# EAGLE schematic Gibbot v3 (EAGLE 5.12)

## Sheet 1 of 3
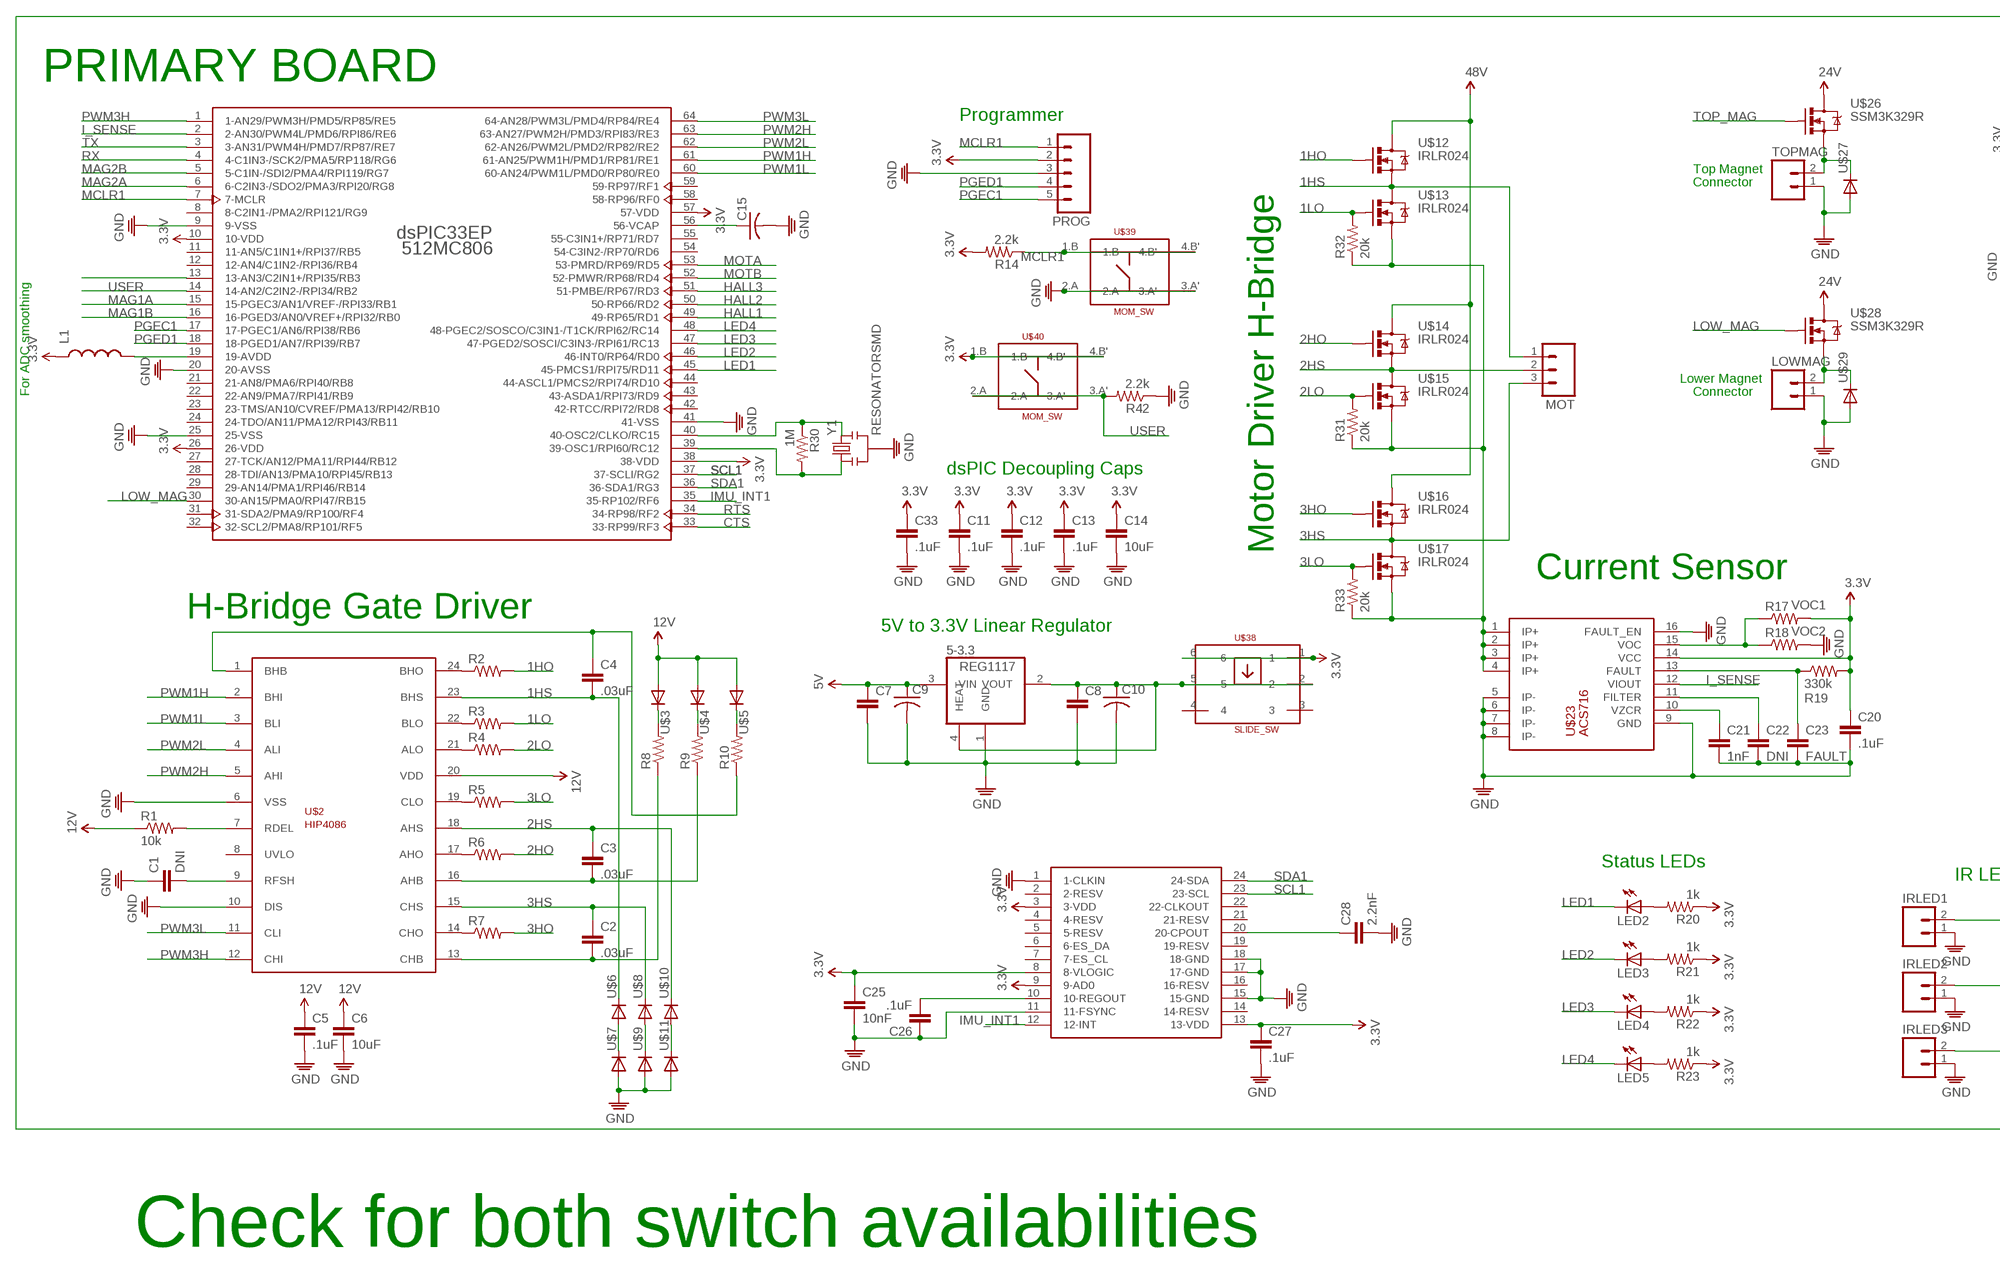
[diagram p0: schematic, sheet 1, part 1 of 2]
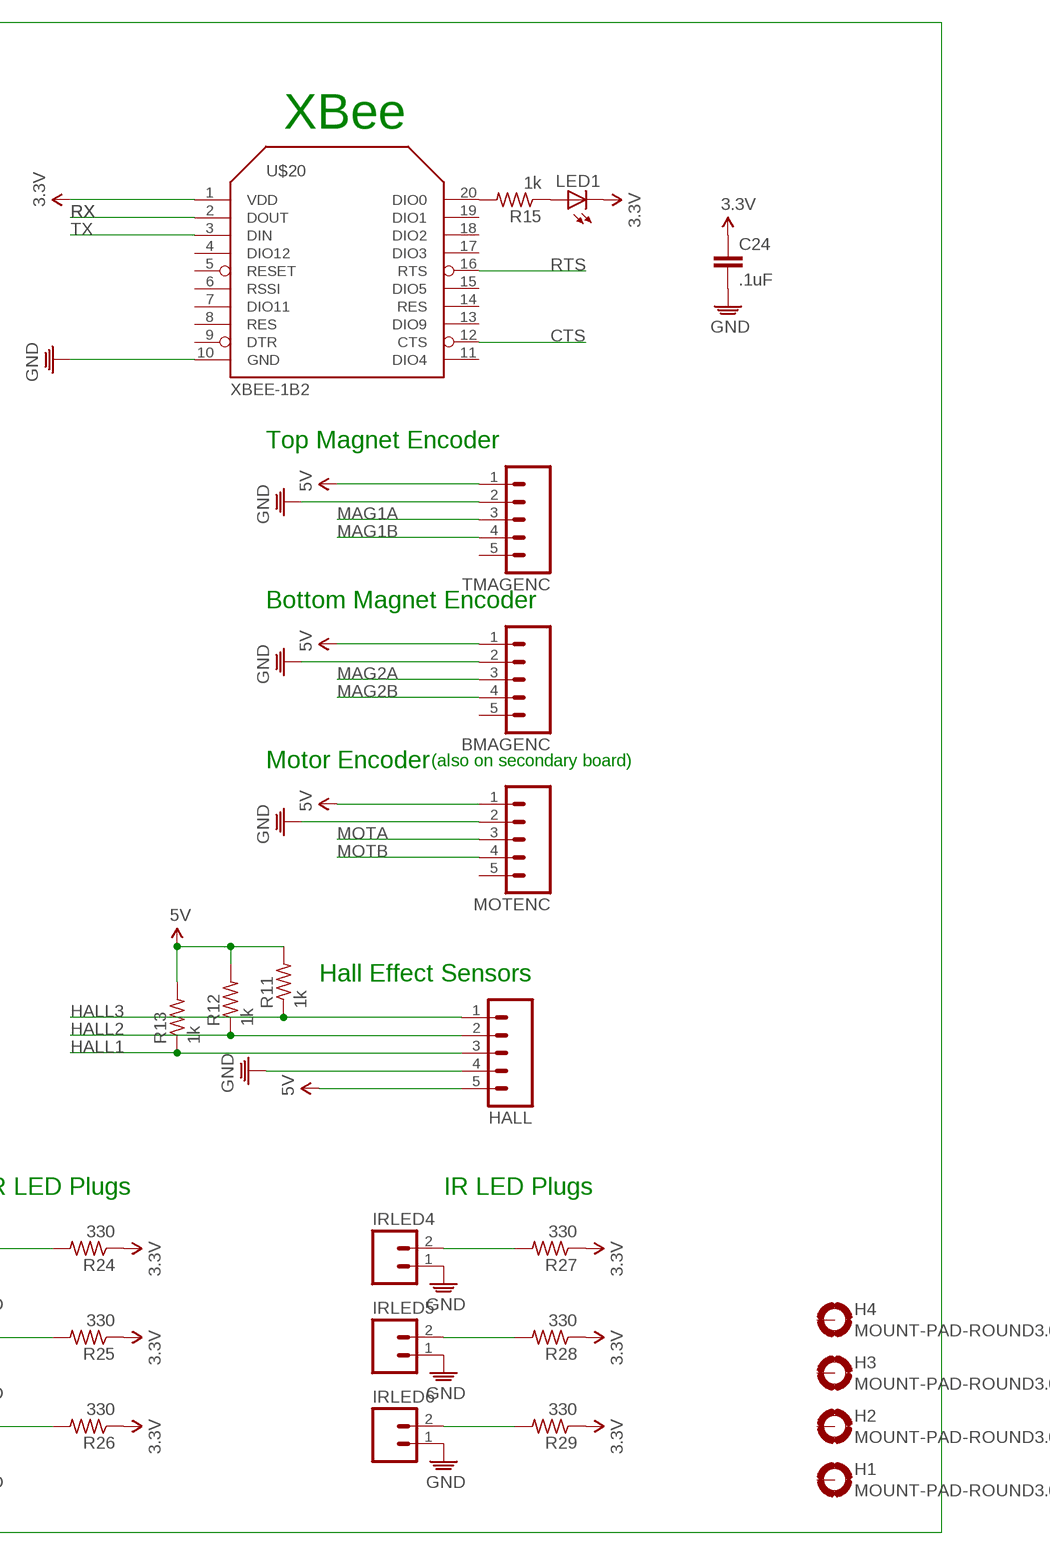
[diagram p1: schematic, sheet 1, part 2 of 2]

### Parts
5-3.3  REG1117  [SOT223]
BMAGENC  M05JST-SH  [JST-SH-5]
C1  DNI  CAP0603-CAP  [0603-CAP]
C2  .03uF  CAP0603-CAP  [0603-CAP]
C3  .03uF  CAP0603-CAP  [0603-CAP]
C4  .03uF  CAP0603-CAP  [0603-CAP]
C5  .1uF  CAP0603-CAP  [0603-CAP]
C6  10uF  CAP_  [AXIAL-5MM]
C7  CAP0603-CAP  [0603-CAP]
C8  CAP0603-CAP  [0603-CAP]
C9  C-USC0603  [C0603]
C10  C-USC0603  [C0603]
C11  .1uF  CAP0603-CAP  [0603-CAP]
C12  .1uF  CAP0603-CAP  [0603-CAP]
C13  .1uF  CAP0603-CAP  [0603-CAP]
C14  10uF  CAPPTH2  [CAP-PTH-SMALL2]
C15  C-USC0603  [C0603]
C20  .1uF  CAP0603-CAP  [0603-CAP]
C21  1nF  CAP0603-CAP  [0603-CAP]
C22  DNI  CAP0603-CAP  [0603-CAP]
C23  FAULT  CAP0603-CAP  [0603-CAP]
C24  .1uF  CAP0603-CAP  [0603-CAP]
C25  10nF  CAP0603-CAP  [0603-CAP]
C26  .1uF  CAP0603-CAP  [0603-CAP]
C27  .1uF  CAP0603-CAP  [0603-CAP]
C28  2.2nF  CAP0603-CAP  [0603-CAP]
C33  .1uF  CAP0603-CAP  [0603-CAP]
H1  MOUNT-PAD-ROUND3.0  [3,0-PAD]
H2  MOUNT-PAD-ROUND3.0  [3,0-PAD]
H3  MOUNT-PAD-ROUND3.0  [3,0-PAD]
H4  MOUNT-PAD-ROUND3.0  [3,0-PAD]
HALL  M05JST-SH  [JST-SH-5]
IRLED1  M02JST-SH  [JST-SH-2]
IRLED2  M02JST-SH  [JST-SH-2]
IRLED3  M02JST-SH  [JST-SH-2]
IRLED4  M02JST-SH  [JST-SH-2]
IRLED5  M02JST-SH  [JST-SH-2]
IRLED6  M02JST-SH  [JST-SH-2]
L1  INDUCTOR0603  [0603]
LED1  LED0603  [LED-0603]
LED2  LED0603  [LED-0603]
LED3  LED0603  [LED-0603]
LED4  LED0603  [LED-0603]
LED5  LED0603  [LED-0603]
LOWMAG  M02JST-SH  [JST-SH-2]
MOT  M03MOLEX-MINI-FIT-JR  [39-30-3036]
MOTENC  M05JST-SH  [JST-SH-5]
PROG  M05PTH  [1X05]
R1  10k  R-US_R0603  [R0603]
R2  R-US_R0603  [R0603]
R3  R-US_R0603  [R0603]
R4  R-US_R0603  [R0603]
R5  R-US_R0603  [R0603]
R6  R-US_R0603  [R0603]
R7  R-US_R0603  [R0603]
R8  R-US_R0603  [R0603]
R9  R-US_R0603  [R0603]
R10  R-US_R0603  [R0603]
R11  1k  R-US_R0603  [R0603]
R12  1k  R-US_R0603  [R0603]
R13  1k  R-US_R0603  [R0603]
R14  2.2k  R-US_R0603  [R0603]
R15  1k  R-US_R0603  [R0603]
R17  VOC1  R-US_R0603  [R0603]
R18  VOC2  R-US_R0603  [R0603]
R19  330k  R-US_R0603  [R0603]
R20  1k  R-US_R0603  [R0603]
R21  1k  R-US_R0603  [R0603]
R22  1k  R-US_R0603  [R0603]
R23  1k  R-US_R0603  [R0603]
R24  330  R-US_R0603  [R0603]
R25  330  R-US_R0603  [R0603]
R26  330  R-US_R0603  [R0603]
R27  330  R-US_R0603  [R0603]
R28  330  R-US_R0603  [R0603]
R29  330  R-US_R0603  [R0603]
R30  1M  R-US_R0603  [R0603]
R31  20k  R-US_R0603  [R0603]
R32  20k  R-US_R0603  [R0603]
R33  20k  R-US_R0603  [R0603]
R42  2.2k  R-US_R0603  [R0603]
TMAGENC  M05JST-SH  [JST-SH-5]
TOPMAG  M02JST-SH  [JST-SH-2]
U$1  DSPIC33EP512MC806  [TQFP64_10X10]
U$2  HIP4086  [SOIC24-W]
U$3  DIODES04  [D0-219AB]
U$4  DIODES04  [D0-219AB]
U$5  DIODES04  [D0-219AB]
U$6  DIODEES1A-D  [DO-214AC]
U$7  DIODEES1A-D  [DO-214AC]
U$8  DIODEES1A-D  [DO-214AC]
U$9  DIODEES1A-D  [DO-214AC]
U$10  DIODEES1A-D  [DO-214AC]
U$11  DIODEES1A-D  [DO-214AC]
U$12  IRLR024  [DPAK]
U$13  IRLR024  [DPAK]
U$14  IRLR024  [DPAK]
U$15  IRLR024  [DPAK]
U$16  IRLR024  [DPAK]
U$17  IRLR024  [DPAK]
U$20  XBEE-1B2  [XBEE-SILK]
U$23  ACS716  [SOIC16-W]
U$26  SSM3K329R  [SOT23F]
U$27  DIODE1N4148  [DIODE-1N4148]
U$28  SSM3K329R  [SOT23F]
U$29  DIODE1N4148  [DIODE-1N4148]
U$30  MPU-9150  [LGA24_4X4]
U$38  SLIDE_SW  [SLIDE_SW]
U$39  MOM_SW  [MOM_SW]
U$40  MOM_SW  [MOM_SW]
Y1  RESONATORSMD  [RESONATOR-SMD]

### Nets
1HO: R2.2 U$12.G
1HS: C4.2 MOT.1 U$2.23(BHS) U$6.CATH(C) U$12.S U$13.D
1LO: R3.2 R32.2 U$13.G
2HO: R6.2 U$14.G
2HS: C3.1 MOT.2 U$2.18(AHS) U$10.CATH(C) U$14.S U$15.D
2LO: R4.2 R31.2 U$15.G
3.3V: C11.1 C12.1 C13.1 C14.1 C20.1 C24.1 C25.1 C27.1 C33.1 L1.1 LED1.C PROG.2 R14.2 R17.2 R19.2 R20.1 R21.1 R22.1 R23.1 R24.1 R25.1 R26.1 R27.1 R28.1 R29.1 U$1.10(10-VDD) U$1.26(26-VDD) U$1.38(38-VDD) U$1.57(57-VDD) U$20.1(VDD) U$23.14(VCC) U$30.3(3-VDD) U$30.8(8-VLOGIC) U$30.9(9-AD0) U$30.13(13-VDD) U$38.1 U$38.6 U$40.1.B U$40.4.B' ; also sheet 3
3HO: R7.2 U$16.G
3HS: C2.1 MOT.3 U$2.15(CHS) U$8.CATH(C) U$16.S U$17.D
3LO: R5.2 R33.2 U$17.G
5V: 5-3.3.3(VIN) BMAGENC.1 C7.1 C9.1 HALL.5 MOTENC.1 R11.2 R12.2 R13.2 TMAGENC.1 ; also sheet 3
12V: C5.1 C6.P$1 R1.1 U$2.20(VDD) U$3.AN(A) U$4.AN(A) U$5.AN(A)
24V: U$26.D U$28.D ; also sheet 3
48V: U$12.D U$14.D U$16.D
CTS: U$1.33(33-RP99/RF3) U$20.12(CTS)
GND: 5-3.3.1(GND) BMAGENC.2 C1.1 C5.2 C6.P$2 C7.2 C8.2 C9.2 C10.2 C11.2 C12.2 C13.2 C14.2 C15.2 C20.2 C21.2 C22.2 C23.2 C24.2 C25.2 C26.1 C27.2 C28.2 C33.2 HALL.4 IRLED1.1 IRLED2.1 IRLED3.1 IRLED4.1 IRLED5.1 IRLED6.1 LOWMAG.1 MOTENC.2 PROG.3 R18.2 R42.1 TMAGENC.2 TOPMAG.1 U$1.9(9-VSS) U$1.20(20-AVSS) U$1.25(25-VSS) U$1.41(41-VSS) U$2.6(VSS) U$2.10(DIS) U$7.AN(A) U$9.AN(A) U$11.AN(A) U$20.10(GND) U$23.5(IP-) U$23.6(IP-) U$23.7(IP-) U$23.8(IP-) U$23.9(GND) U$23.16(FAULT_EN) U$27.A U$29.A U$30.1(1-CLKIN) U$30.11(11-FSYNC) U$30.15(15-GND) U$30.17(17-GND) U$30.18(18-GND) U$39.2.A U$39.3.A' Y1.2 ; also sheet 3
HALL1: HALL.3 R13.1 U$1.49(49-RP65/RD1)
HALL2: HALL.2 R12.1 U$1.50(50-RP66/RD2)
HALL3: HALL.1 R11.1 U$1.51(51-PMBE/RP67/RD3)
I_SENSE: U$1.2(2-AN30/PWM4L/PMD6/RPI86/RE6) U$23.12(VIOUT)
IMU_INT1: U$1.35(35-RP102/RF6) U$30.12(12-INT)
IRLED6: IRLED6.2 R29.2
LED1: LED2.C U$1.45(45-PMCS1/RPI75/RD11)
LED2: LED3.C U$1.46(46-INT0/RP64/RD0)
LED3: LED4.C U$1.47(47-PGED2/SOSCI/C3IN3-/RPI61/RC13)
LED4: LED5.C U$1.48(48-PGEC2/SOSCO/C3IN1-/T1CK/RPI62/RC14)
LOW_MAG: U$1.30(30-AN15/PMA0/RPI47/RB15) U$28.G
MAG1A: TMAGENC.3 U$1.15(15-PGEC3/AN1/VREF-/RPI33/RB1)
MAG1B: TMAGENC.4 U$1.16(16-PGED3/AN0/VREF+/RPI32/RB0)
MAG2A: BMAGENC.3 U$1.6(6-C2IN3-/SDO2/PMA3/RPI20/RG8)
MAG2B: BMAGENC.4 U$1.5(5-C1IN-/SDI2/PMA4/RPI119/RG7)
MCLR1: PROG.1 R14.1 U$1.7(7-MCLR) U$39.1.B U$39.4.B'
MOTA: MOTENC.3 U$1.53(53-PMRD/RP69/RD5)
MOTB: MOTENC.4 U$1.52(52-PMWR/RP68/RD4)
N$4: R1.2 U$2.7(RDEL)
N$5: C1.2 U$2.9(RFSH)
N$6: R2.1 U$2.24(BHO)
N$7: R3.1 U$2.22(BLO)
N$8: R4.1 U$2.21(ALO)
N$9: R5.1 U$2.19(CLO)
N$10: R6.1 U$2.17(AHO)
N$11: R7.1 U$2.14(CHO)
N$12: C2.2 R8.1 U$2.13(CHB)
N$13: C3.2 R9.1 U$2.16(AHB)
N$14: R15.2 U$20.20(DIO0)
N$15: LED1.A R15.1
N$16: C15.1 U$1.56(56-VCAP)
N$17: C4.1 R10.1 U$2.1(BHB)
N$18: R10.2 U$5.CATH(C)
N$19: R9.2 U$4.CATH(C)
N$20: R8.2 U$3.CATH(C)
N$21: U$6.AN(A) U$7.CATH(C)
N$22: U$8.AN(A) U$9.CATH(C)
N$23: U$10.AN(A) U$11.CATH(C)
N$24: C23.1 R19.1 U$23.13(FAULT)
N$25: C21.1 U$23.10(VZCR)
N$27: C22.1 U$23.11(FILTER)
N$28: R31.1 R32.1 R33.1 U$13.S U$15.S U$17.S U$23.1(IP+) U$23.2(IP+) U$23.3(IP+) U$23.4(IP+)
N$29: LED2.A R20.2
N$30: LED3.A R21.2
N$31: LED4.A R22.2
N$32: R17.1 R18.1 U$23.15(VOC)
N$34: U$1.13(13-AN3/C2IN1+/RPI35/RB3)
N$39: LED5.A R23.2
N$40: TOPMAG.2 U$26.S U$27.C
N$41: LOWMAG.2 U$28.S U$29.C
N$42: R30.2 U$1.39(39-OSC1/RPI60/RC12) Y1.1
N$43: R30.1 U$1.40(40-OSC2/CLKO/RC15) Y1.3
N$44: C26.2 U$30.10(10-REGOUT)
N$45: IRLED1.2 R24.2
N$46: C28.1 U$30.20(20-CPOUT)
N$47: IRLED2.2 R25.2
N$49: IRLED3.2 R26.2
N$51: IRLED4.2 R27.2
N$53: IRLED5.2 R28.2
N$56: 5-3.3.2(VOUT) 5-3.3.4(HEAT) C8.1 C10.1 U$38.2 U$38.5
N$57: L1.2 U$1.19(19-AVDD)
PGEC1: PROG.5 U$1.17(17-PGEC1/AN6/RPI38/RB6)
PGED1: PROG.4 U$1.18(18-PGED1/AN7/RPI39/RB7)
PWM1H: U$1.61(61-AN25/PWM1H/PMD1/RP81/RE1) U$2.2(BHI)
PWM1L: U$1.60(60-AN24/PWM1L/PMD0/RP80/RE0) U$2.3(BLI)
PWM2H: U$1.63(63-AN27/PWM2H/PMD3/RPI83/RE3) U$2.5(AHI)
PWM2L: U$1.62(62-AN26/PWM2L/PMD2/RP82/RE2) U$2.4(ALI)
PWM3H: U$1.1(1-AN29/PWM3H/PMD5/RP85/RE5) U$2.12(CHI)
PWM3L: U$1.64(64-AN28/PWM3L/PMD4/RP84/RE4) U$2.11(CLI)
RTS: U$1.34(34-RP98/RF2) U$20.16(RTS)
RX: U$1.4(4-C1IN3-/SCK2/PMA5/RP118/RG6) U$20.2(DOUT)
SCL1: U$1.37(37-SCLI/RG2) U$30.23(23-SCL)
SDA1: U$1.36(36-SDA1/RG3) U$30.24(24-SDA)
TOP_MAG: U$26.G
TX: U$1.3(3-AN31/PWM4H/PMD7/RP87/RE7) U$20.3(DIN)
USER: R42.2 U$1.14(14-AN2/C2IN2-/RPI34/RB2) U$40.2.A U$40.3.A' ; also sheet 3
Unconnected: BMAGENC.5 H1.B3,0(MOUNT) H2.B3,0(MOUNT) H3.B3,0(MOUNT) H4.B3,0(MOUNT) MOTENC.5 TMAGENC.5 U$1.8(8-C2IN1-/PMA2/RPI121/RG9) U$1.11(11-AN5/C1IN1+/RPI37/RB5) U$1.12(12-AN4/C1IN2-/RPI36/RB4) U$1.21(21-AN8/PMA6/RPI40/RB8) U$1.22(22-AN9/PMA7/RPI41/RB9) U$1.23(23-TMS/AN10/CVREF/PMA13/RPI42/RB10) U$1.24(24-TDO/AN11/PMA12/RPI43/RB11) U$1.27(27-TCK/AN12/PMA11/RPI44/RB12) U$1.28(28-TDI/AN13/PMA10/RPI45/RB13) U$1.29(29-AN14/PMA1/RPI46/RB14) U$1.31(31-SDA2/PMA9/RP100/RF4) U$1.32(32-SCL2/PMA8/RP101/RF5) U$1.42(42-RTCC/RPI72/RD8) U$1.43(43-ASDA1/RPI73/RD9) U$1.44(44-ASCL1/PMCS2/RPI74/RD10) U$1.54(54-C3IN2-/RP70/RD6) U$1.55(55-C3IN1+/RP71/RD7) U$1.58(58-RP96/RF0) U$1.59(59-RP97/RF1) U$2.8(UVLO) U$20.4(DIO12) U$20.5(RESET) U$20.6(RSSI) U$20.7(DIO11) U$20.8(RES) U$20.9(DTR) U$20.11(DIO4) U$20.13(DIO9) U$20.14(RES) U$20.15(DIO5) U$20.17(DIO3) U$20.18(DIO2) U$20.19(DIO1) U$30.2(2-RESV) U$30.4(4-RESV) U$30.5(5-RESV) U$30.6(6-ES_DA) U$30.7(7-ES_CL) U$30.14(14-RESV) U$30.16(16-RESV) U$30.19(19-RESV) U$30.21(21-RESV) U$30.22(22-CLKOUT) U$38.3 U$38.4

### Notes on the sheet
- PRIMARY BOARD
- XBee
- Programmer
- Top Magnet
- Connector
- Top Magnet Encoder
- Lower Magnet
- For ADC smoothing | Connector
- Bottom Magnet Encoder
- dsPIC Decoupling Caps
- Motor Driver H-Bridge
- Motor Encoder | (also on secondary board)
- Current Sensor
- H-Bridge Gate Driver
- 5V to 3.3V Linear Regulator
- Hall Effect Sensors
- Status LEDs
- IR LED Plugs | IR LED Plugs
- Check for both switch availabilities

## Sheet 2 of 3
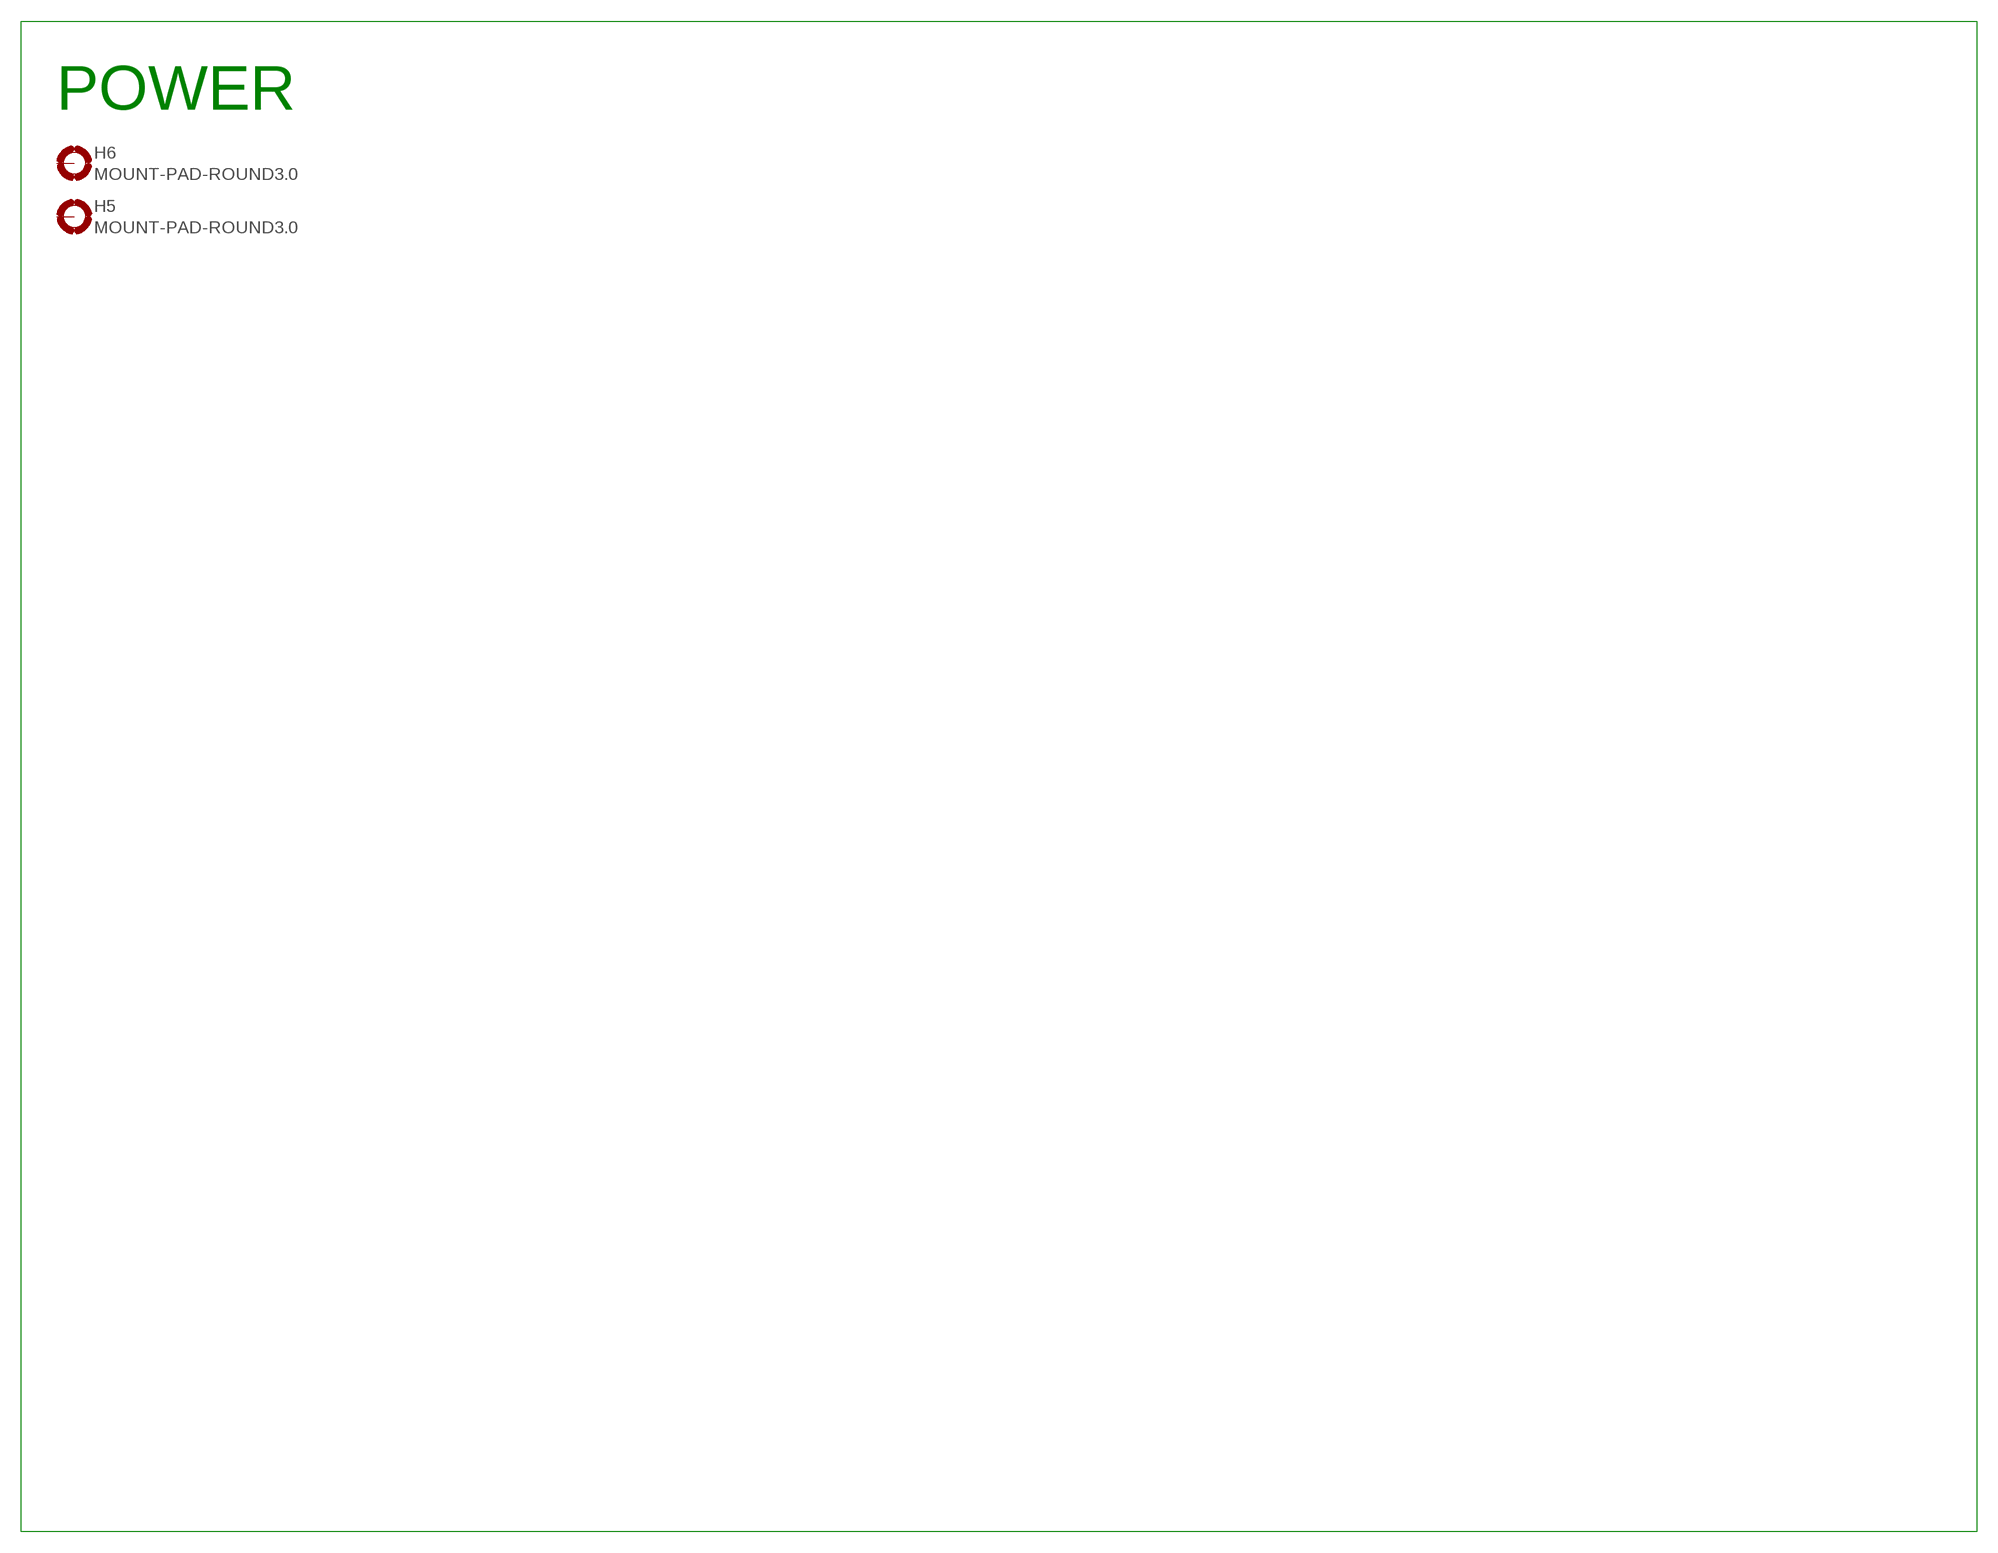
[diagram p2: schematic, sheet 2]

### Parts
H5  MOUNT-PAD-ROUND3.0  [3,0-PAD]
H6  MOUNT-PAD-ROUND3.0  [3,0-PAD]
Unconnected: H5.B3,0(MOUNT) H6.B3,0(MOUNT)

### Notes on the sheet
- POWER

## Sheet 3 of 3
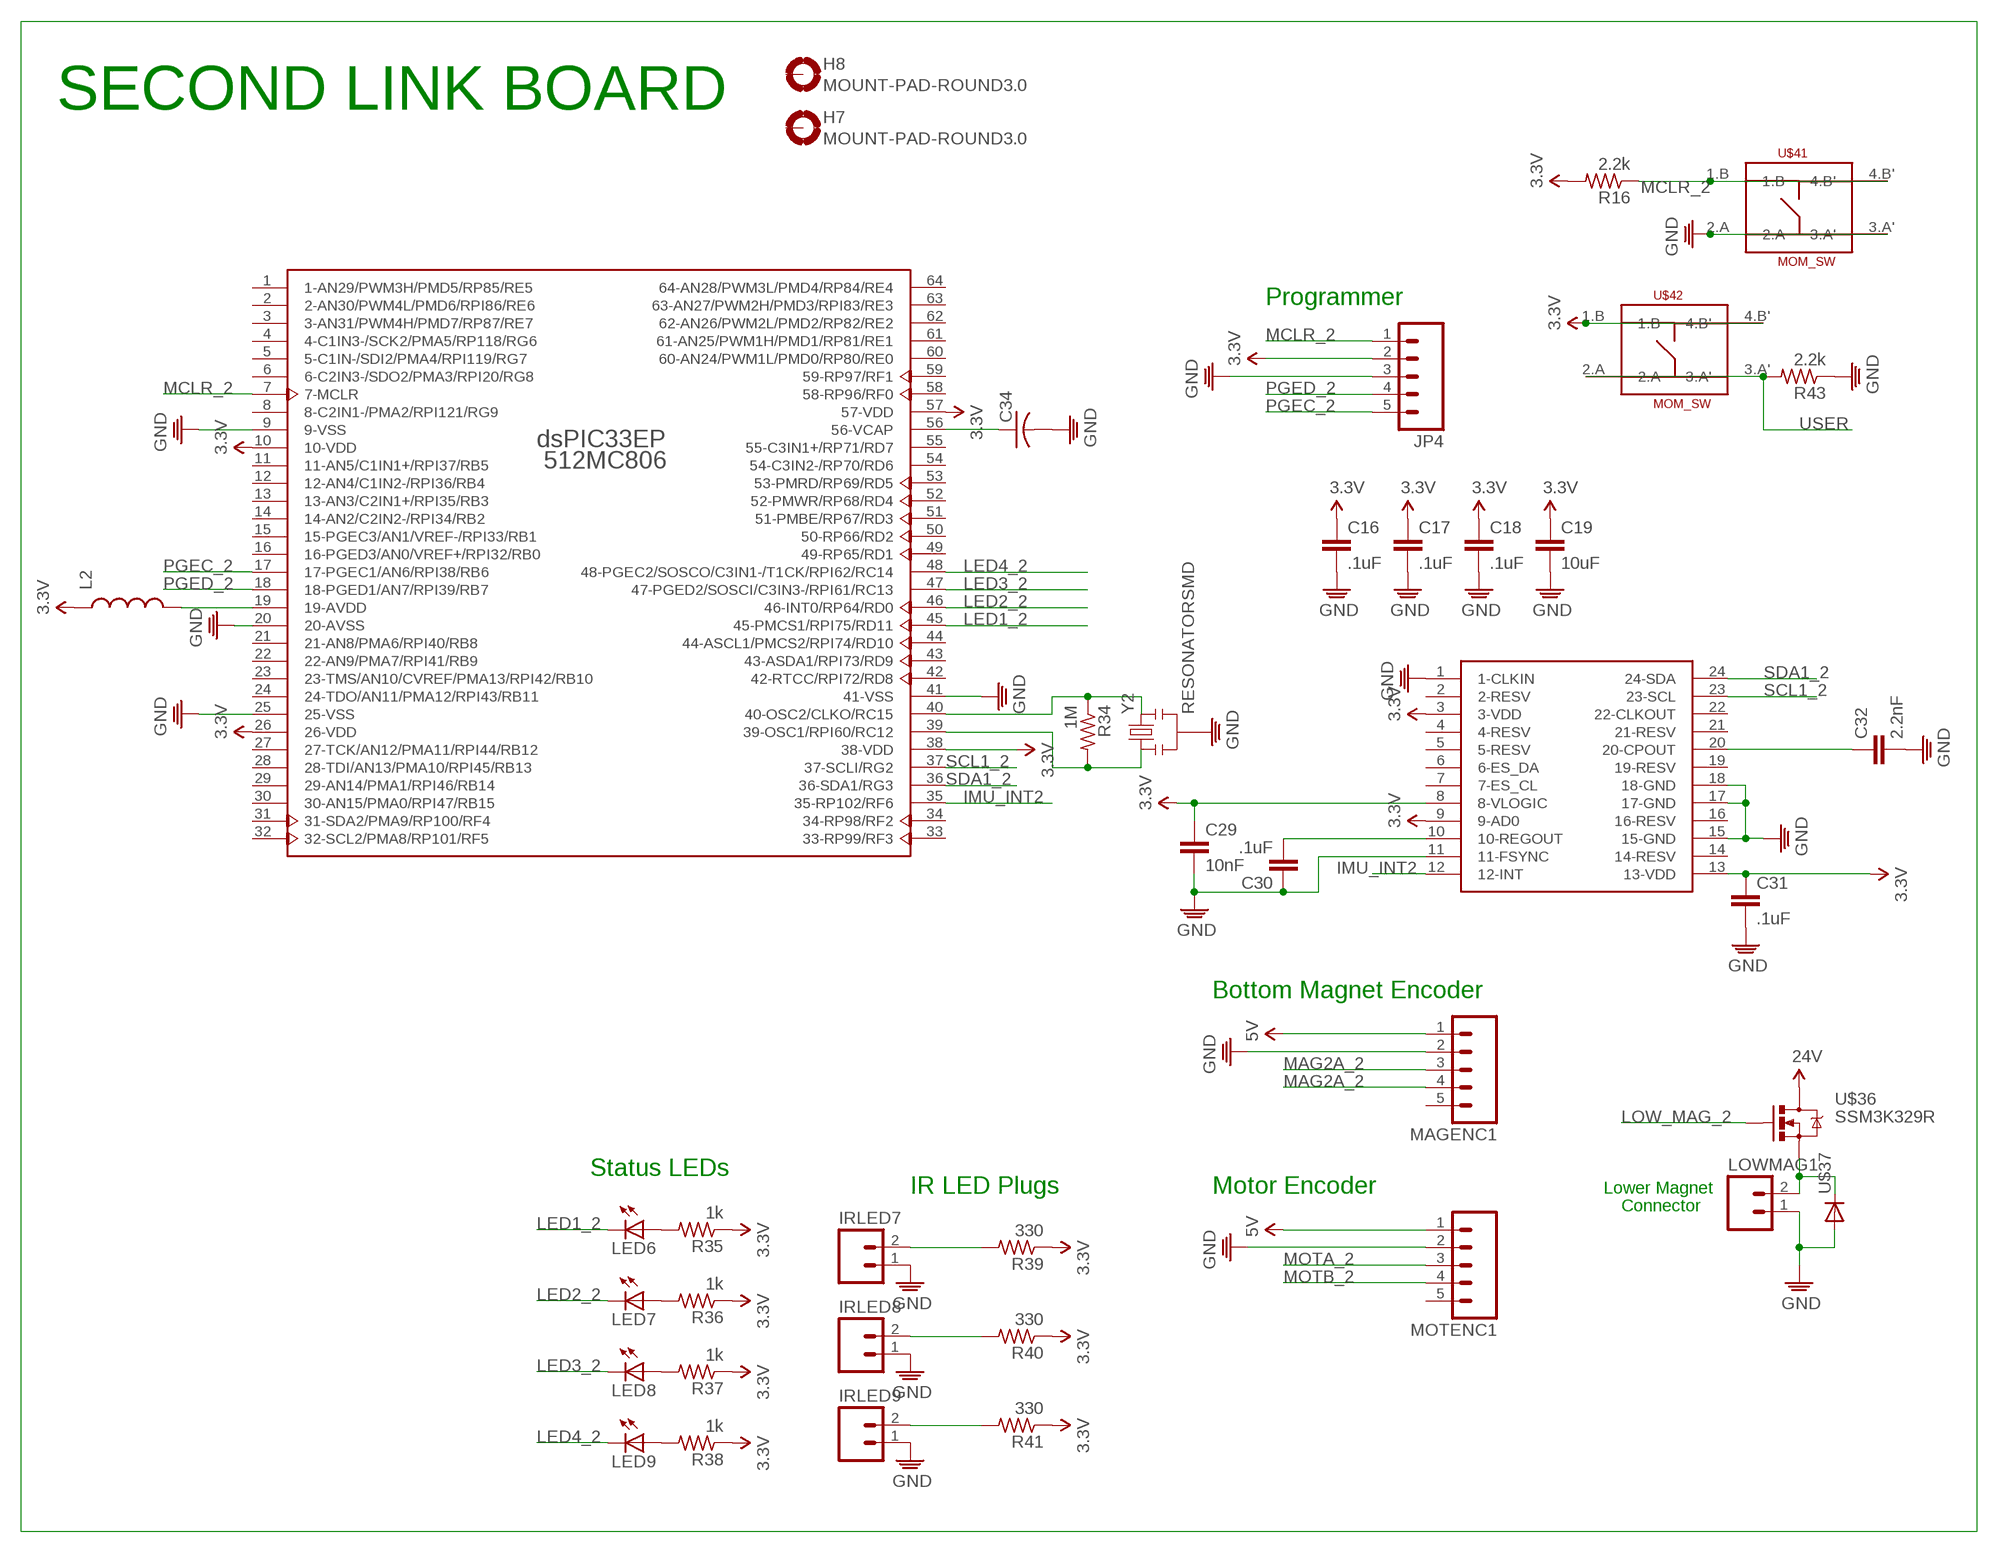
[diagram p3: schematic, sheet 3]

### Parts
C16  .1uF  CAP0603-CAP  [0603-CAP]
C17  .1uF  CAP0603-CAP  [0603-CAP]
C18  .1uF  CAP0603-CAP  [0603-CAP]
C19  10uF  CAPPTH2  [CAP-PTH-SMALL2]
C29  10nF  CAP0603-CAP  [0603-CAP]
C30  .1uF  CAP0603-CAP  [0603-CAP]
C31  .1uF  CAP0603-CAP  [0603-CAP]
C32  2.2nF  CAP0603-CAP  [0603-CAP]
C34  C-USC0603  [C0603]
H7  MOUNT-PAD-ROUND3.0  [3,0-PAD]
H8  MOUNT-PAD-ROUND3.0  [3,0-PAD]
IRLED7  M02JST-SH  [JST-SH-2]
IRLED8  M02JST-SH  [JST-SH-2]
IRLED9  M02JST-SH  [JST-SH-2]
JP4  M05PTH  [1X05]
L2  INDUCTOR0603  [0603]
LED6  LED0603  [LED-0603]
LED7  LED0603  [LED-0603]
LED8  LED0603  [LED-0603]
LED9  LED0603  [LED-0603]
LOWMAG1  M02JST-SH  [JST-SH-2]
MAGENC1  M05JST-SH  [JST-SH-5]
MOTENC1  M05JST-SH  [JST-SH-5]
R16  2.2k  R-US_R0603  [R0603]
R34  1M  R-US_R0603  [R0603]
R35  1k  R-US_R0603  [R0603]
R36  1k  R-US_R0603  [R0603]
R37  1k  R-US_R0603  [R0603]
R38  1k  R-US_R0603  [R0603]
R39  330  R-US_R0603  [R0603]
R40  330  R-US_R0603  [R0603]
R41  330  R-US_R0603  [R0603]
R43  2.2k  R-US_R0603  [R0603]
U$22  DSPIC33EP512MC806  [TQFP64_10X10]
U$31  MPU-9150  [LGA24_4X4]
U$36  SSM3K329R  [SOT23F]
U$37  DIODE1N4148  [DIODE-1N4148]
U$41  MOM_SW  [MOM_SW]
U$42  MOM_SW  [MOM_SW]
Y2  RESONATORSMD  [RESONATOR-SMD]

### Nets
3.3V: C16.1 C17.1 C18.1 C19.1 C29.1 C31.1 JP4.2 L2.1 R16.2 R35.1 R36.1 R37.1 R38.1 R39.1 R40.1 R41.1 U$22.10(10-VDD) U$22.26(26-VDD) U$22.38(38-VDD) U$22.57(57-VDD) U$31.3(3-VDD) U$31.8(8-VLOGIC) U$31.9(9-AD0) U$31.13(13-VDD) U$42.1.B U$42.4.B' ; also sheet 1
5V: MAGENC1.1 MOTENC1.1 ; also sheet 1
24V: U$36.D ; also sheet 1
GND: C16.2 C17.2 C18.2 C19.2 C29.2 C30.1 C31.2 C32.2 C34.2 IRLED7.1 IRLED8.1 IRLED9.1 JP4.3 LOWMAG1.1 MAGENC1.2 MOTENC1.2 R43.1 U$22.9(9-VSS) U$22.20(20-AVSS) U$22.25(25-VSS) U$22.41(41-VSS) U$31.1(1-CLKIN) U$31.11(11-FSYNC) U$31.15(15-GND) U$31.17(17-GND) U$31.18(18-GND) U$37.A U$41.2.A U$41.3.A' Y2.2 ; also sheet 1
IMU_INT2: U$22.35(35-RP102/RF6) U$31.12(12-INT)
LED1_2: LED6.C U$22.45(45-PMCS1/RPI75/RD11)
LED2_2: LED7.C U$22.46(46-INT0/RP64/RD0)
LED3_2: LED8.C U$22.47(47-PGED2/SOSCI/C3IN3-/RPI61/RC13)
LED4_2: LED9.C U$22.48(48-PGEC2/SOSCO/C3IN1-/T1CK/RPI62/RC14)
LOW_MAG_2: U$36.G
MAG2A_2: MAGENC1.3 MAGENC1.4
MCLR_2: JP4.1 R16.1 U$22.7(7-MCLR) U$41.1.B U$41.4.B'
MOTA_2: MOTENC1.3
MOTB_2: MOTENC1.4
N$33: L2.2 U$22.19(19-AVDD)
N$35: C34.1 U$22.56(56-VCAP)
N$36: R34.2 U$22.39(39-OSC1/RPI60/RC12) Y2.1
N$37: R34.1 U$22.40(40-OSC2/CLKO/RC15) Y2.3
N$48: C30.2 U$31.10(10-REGOUT)
N$50: C32.1 U$31.20(20-CPOUT)
N$52: LOWMAG1.2 U$36.S U$37.C
N$55: LED6.A R35.2
N$58: LED7.A R36.2
N$59: LED8.A R37.2
N$60: LED9.A R38.2
N$61: IRLED7.2 R39.2
N$62: IRLED8.2 R40.2
N$63: IRLED9.2 R41.2
PGEC_2: JP4.5 U$22.17(17-PGEC1/AN6/RPI38/RB6)
PGED_2: JP4.4 U$22.18(18-PGED1/AN7/RPI39/RB7)
SCL1_2: U$22.37(37-SCLI/RG2) U$31.23(23-SCL)
SDA1_2: U$22.36(36-SDA1/RG3) U$31.24(24-SDA)
USER: R43.2 U$42.2.A U$42.3.A' ; also sheet 1
Unconnected: H7.B3,0(MOUNT) H8.B3,0(MOUNT) MAGENC1.5 MOTENC1.5 U$22.1(1-AN29/PWM3H/PMD5/RP85/RE5) U$22.2(2-AN30/PWM4L/PMD6/RPI86/RE6) U$22.3(3-AN31/PWM4H/PMD7/RP87/RE7) U$22.4(4-C1IN3-/SCK2/PMA5/RP118/RG6) U$22.5(5-C1IN-/SDI2/PMA4/RPI119/RG7) U$22.6(6-C2IN3-/SDO2/PMA3/RPI20/RG8) U$22.8(8-C2IN1-/PMA2/RPI121/RG9) U$22.11(11-AN5/C1IN1+/RPI37/RB5) U$22.12(12-AN4/C1IN2-/RPI36/RB4) U$22.13(13-AN3/C2IN1+/RPI35/RB3) U$22.14(14-AN2/C2IN2-/RPI34/RB2) U$22.15(15-PGEC3/AN1/VREF-/RPI33/RB1) U$22.16(16-PGED3/AN0/VREF+/RPI32/RB0) U$22.21(21-AN8/PMA6/RPI40/RB8) U$22.22(22-AN9/PMA7/RPI41/RB9) U$22.23(23-TMS/AN10/CVREF/PMA13/RPI42/RB10) U$22.24(24-TDO/AN11/PMA12/RPI43/RB11) U$22.27(27-TCK/AN12/PMA11/RPI44/RB12) U$22.28(28-TDI/AN13/PMA10/RPI45/RB13) U$22.29(29-AN14/PMA1/RPI46/RB14) U$22.30(30-AN15/PMA0/RPI47/RB15) U$22.31(31-SDA2/PMA9/RP100/RF4) U$22.32(32-SCL2/PMA8/RP101/RF5) U$22.33(33-RP99/RF3) U$22.34(34-RP98/RF2) U$22.42(42-RTCC/RPI72/RD8) U$22.43(43-ASDA1/RPI73/RD9) U$22.44(44-ASCL1/PMCS2/RPI74/RD10) U$22.49(49-RP65/RD1) U$22.50(50-RP66/RD2) U$22.51(51-PMBE/RP67/RD3) U$22.52(52-PMWR/RP68/RD4) U$22.53(53-PMRD/RP69/RD5) U$22.54(54-C3IN2-/RP70/RD6) U$22.55(55-C3IN1+/RP71/RD7) U$22.58(58-RP96/RF0) U$22.59(59-RP97/RF1) U$22.60(60-AN24/PWM1L/PMD0/RP80/RE0) U$22.61(61-AN25/PWM1H/PMD1/RP81/RE1) U$22.62(62-AN26/PWM2L/PMD2/RP82/RE2) U$22.63(63-AN27/PWM2H/PMD3/RPI83/RE3) U$22.64(64-AN28/PWM3L/PMD4/RP84/RE4) U$31.2(2-RESV) U$31.4(4-RESV) U$31.5(5-RESV) U$31.6(6-ES_DA) U$31.7(7-ES_CL) U$31.14(14-RESV) U$31.16(16-RESV) U$31.19(19-RESV) U$31.21(21-RESV) U$31.22(22-CLKOUT)

### Notes on the sheet
- SECOND LINK BOARD
- Programmer
- Bottom Magnet Encoder
- Status LEDs
- IR LED Plugs | Motor Encoder | Lower Magnet
- Connector

## Library data of the parts
5-3.3 = Gibbot:REG1117: 800mA and 1A Low Dropout (LDO) Positive Regulator 1.8V, 2.5V, 2.85V, 3.3V, 5V, and Adj
BMAGENC HALL JP4 MAGENC1 MOTENC MOTENC1 PROG TMAGENC = Gibbot:M05: Header 5 Standard 5-pin 0.1" header. Use with straight break away headers (SKU : PRT-00116), right angle break away headers (PRT-00553), swiss pins (PRT-00743), machine pins (PRT-00117), and female headers (PRT-00115). Molex polarized connector foot print use with SKU : PRT-08230 with associated crimp pins and housings.
C1-C8 C11-C14 C16-C33 = Gibbot:CAP: Capacitor Standard 0603 ceramic capacitor, and 0.1" leaded capacitor.
C9 C10 C15 C34 = Gibbot:C-US: CAPACITOR, American symbol
H1-H8 = Gibbot:MOUNT-PAD-ROUND: MOUNTING PAD, round
IRLED1-IRLED9 LOWMAG LOWMAG1 TOPMAG = Gibbot:M02: Header 2 Standard 2-pin 0.1" header. Use with straight break away headers (SKU : PRT-00116), right angle break away headers (PRT-00553), swiss pins (PRT-00743), machine pins (PRT-00117), and female headers (PRT-00115). Molex polarized connector foot print use with SKU : PRT-08233 with associated crimp pins and housings.
L1 L2 = Gibbot:INDUCTOR: Inductors Basic Inductor/Choke - 0603 and 1206. Footprints are not proven and vary greatly between part numbers.
LED1-LED9 = Gibbot:LED: LEDs Standard schematic elements and footprints for 5mm, 3mm, 1206, and 0603 sized LEDs. 5mm - Spark Fun Electronics SKU : COM-00529 (and others)
MOT = Gibbot:M03: Header 3 Standard 3-pin 0.1" header. Use with straight break away headers (SKU : PRT-00116), right angle break away headers (PRT-00553), swiss pins (PRT-00743), machine pins (PRT-00117), and female headers (PRT-00115). Molex polarized connector foot print use with SKU : PRT-08232 with associated crimp pins and housings.
R1-R43 = Gibbot:R-US_: RESISTOR, American symbol
U$1 U$22 = Gibbot:DSPIC33EP512MC806
U$2 = Gibbot:HIP4086
U$3-U$11 U$27 U$29 U$37 = Gibbot:DIODE: Diode These are standard reverse protection diodes and small signal diodes. SMA package can handle up to about 1A. SOD-323 can handle about 200mA. What the SOD-323 package when ordering, there are some mfgs out there that are 5-pin packages.
U$12-U$17 = Gibbot:IRLR024
U$20 = Gibbot:XBEE-1
U$23 = Gibbot:ACS716
U$26 U$28 U$36 = Gibbot:SSM3K329R
U$30 U$31 = Gibbot:MPU-9150
U$38 = Gibbot:SLIDE_SW
U$39-U$42 = Gibbot:MOM_SW
Y1 Y2 = Gibbot:RESONATOR: Resonator Small SMD resonator. This is the itty bitty 10/20MHz resonators with built in caps. CSTCE10M0G55 and CSTCE20M0V53. Footprint has been reviewed closely but hasn't been tested yet.